# Altium project adapter-50-100mil-x6.PrjPcb
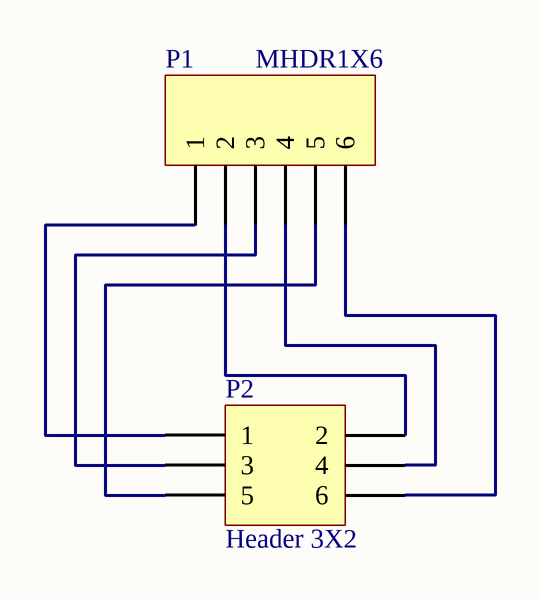
[diagram p0: adapter-50-100mil-x6.SchDoc]
1 sheet, 2 parts. Net scope: global (net labels, ports and power ports of the same name join across sheets).
Board file: adapter-50-100mil-x6.PcbDoc

## Sheet adapter-50-100mil-x6.SchDoc
size A

### Parts
P1  MHDR1X6  [MHDR1X6]
P2  Header 3X2  [HDR2X3]

### Nets
NetP1_1: P1.1 P2.1
NetP1_2: P1.2 P2.2
NetP1_3: P1.3 P2.3
NetP1_4: P1.4 P2.4
NetP1_5: P1.5 P2.5
NetP1_6: P1.6 P2.6

### Library data of the parts
P1 = MHDR1X6: Header, 6-Pin; LatestRevisionDate: 17-Jul-2002; LatestRevisionNote: Re-released for DXP Platform.; Publisher: Altium Limited
P2 = Header 3X2: Header, 3-Pin, Dual row; LatestRevisionDate: 17-Jul-2002; LatestRevisionNote: Re-released for DXP Platform.; Publisher: Altium Limited